# Altium schematic sheet 10.SchDoc
size 513 x 386 mm
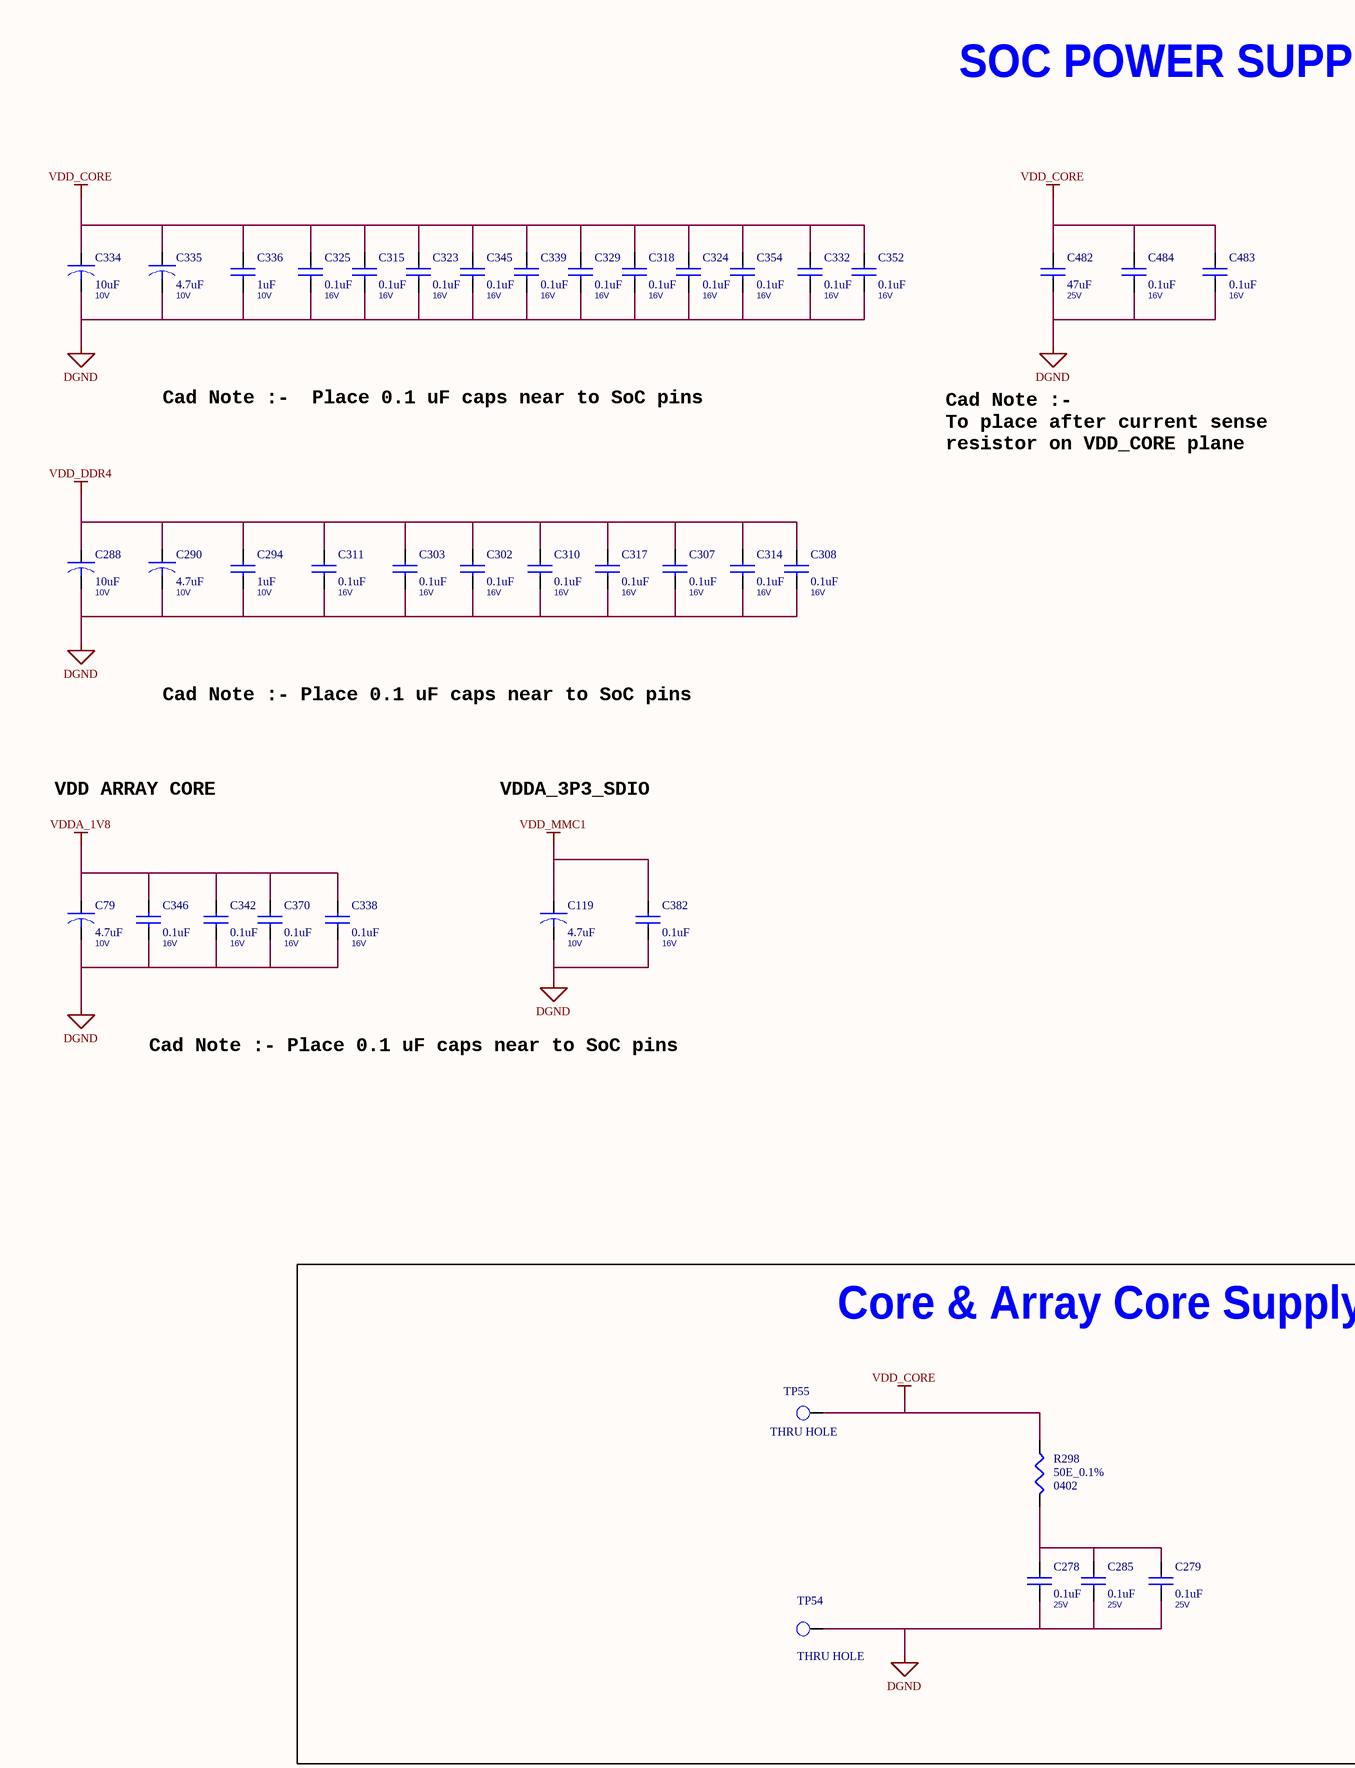
[diagram p0: 10.SchDoc, left]
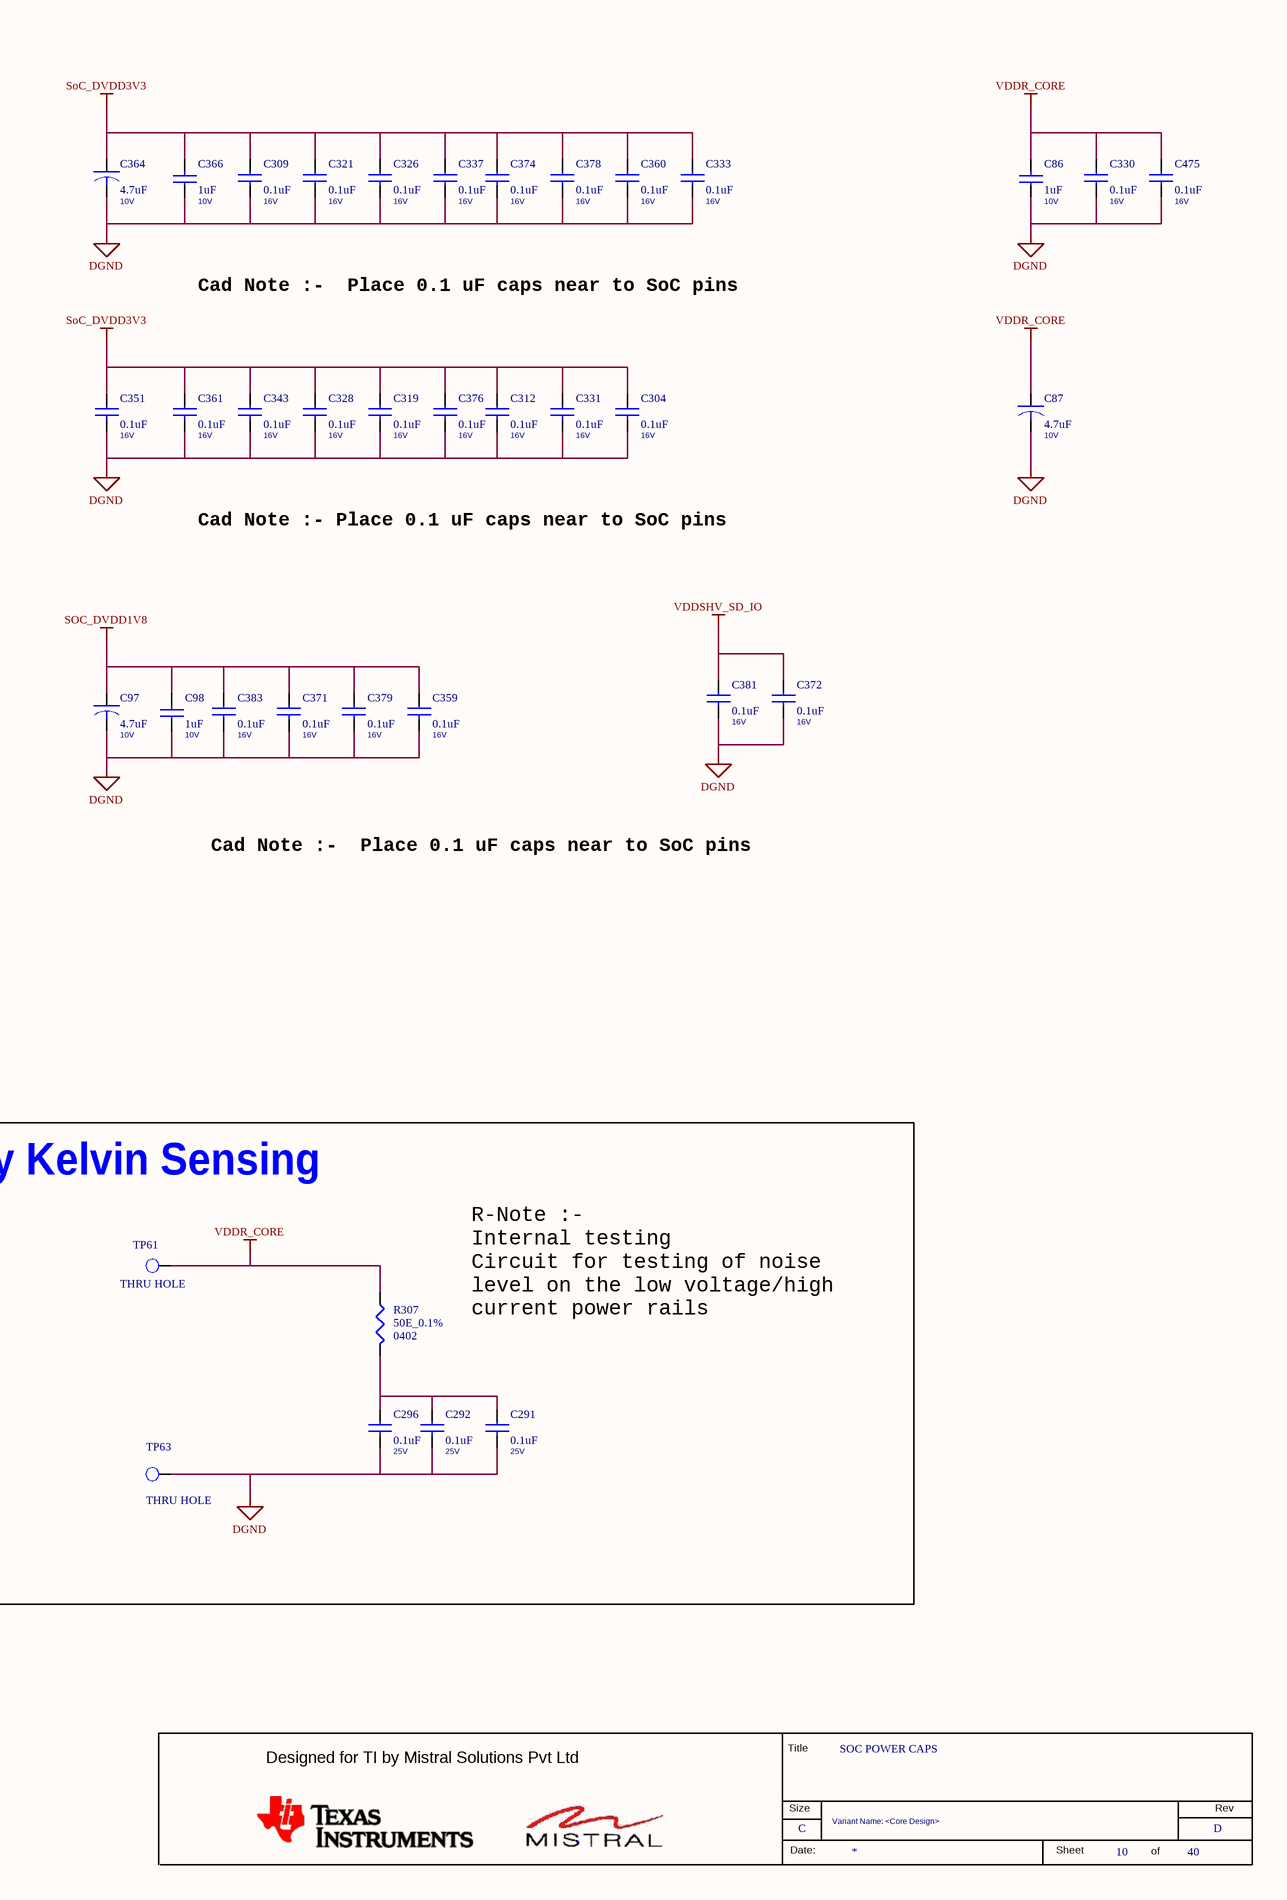
[diagram p1: 10.SchDoc, right]

## Parts
*  RevCode: D  Title: SOC POWER CAPS  Page Size: C  Page Number: 10  Page Count: 40  Variant Name: <Core Design>  (hidden comment: MISTRAL_TITLEBLK_CSIZE)  (graphical)
C79  4.7uF  Voltage: 10V  [CAP0402_0-75]
C86  1uF  Voltage: 10V  [CAP0402_0-75]
C87  4.7uF  Voltage: 10V  [CAP0402_0-75]
C97  4.7uF  Voltage: 10V  [CAP0402_0-75]
C98  1uF  Voltage: 10V  [CAP0402_0-75]
C119  4.7uF  Voltage: 10V  [CAP0402_0-75]
C278  0.1uF  Voltage: 25V  [CAP0402_0-75]
C279  0.1uF  Voltage: 25V  [CAP0402_0-75]
C285  0.1uF  Voltage: 25V  [CAP0402_0-75]
C288  10uF  Voltage: 10V  [CAP0402_0-75]
C290  4.7uF  Voltage: 10V  [CAP0402_0-75]
C291  0.1uF  Voltage: 25V  [CAP0402_0-75]
C292  0.1uF  Voltage: 25V  [CAP0402_0-75]
C294  1uF  Voltage: 10V  [CAP0402_0-75]
C296  0.1uF  Voltage: 25V  [CAP0402_0-75]
C302  0.1uF  Voltage: 16V  [CAP0201_0-5]
C303  0.1uF  Voltage: 16V  [CAP0201_0-5]
C304  0.1uF  Voltage: 16V  [CAP0201_0-5]
C307  0.1uF  Voltage: 16V  [CAP0201_0-5]
C308  0.1uF  Voltage: 16V  [CAP0201_0-5]
C309  0.1uF  Voltage: 16V  [CAP0201_0-5]
C310  0.1uF  Voltage: 16V  [CAP0201_0-5]
C311  0.1uF  Voltage: 16V  [CAP0201_0-5]
C312  0.1uF  Voltage: 16V  [CAP0201_0-5]
C314  0.1uF  Voltage: 16V  [CAP0201_0-5]
C315  0.1uF  Voltage: 16V  [CAP0201_0-5]
C317  0.1uF  Voltage: 16V  [CAP0201_0-5]
C318  0.1uF  Voltage: 16V  [CAP0201_0-5]
C319  0.1uF  Voltage: 16V  [CAP0201_0-5]
C321  0.1uF  Voltage: 16V  [CAP0201_0-5]
C323  0.1uF  Voltage: 16V  [CAP0201_0-5]
C324  0.1uF  Voltage: 16V  [CAP0201_0-5]
C325  0.1uF  Voltage: 16V  [CAP0201_0-5]
C326  0.1uF  Voltage: 16V  [CAP0201_0-5]
C328  0.1uF  Voltage: 16V  [CAP0201_0-5]
C329  0.1uF  Voltage: 16V  [CAP0201_0-5]
C330  0.1uF  Voltage: 16V  [CAP0201_0-5]
C331  0.1uF  Voltage: 16V  [CAP0201_0-5]
C332  0.1uF  Voltage: 16V  [CAP0201_0-5]
C333  0.1uF  Voltage: 16V  [CAP0201_0-5]
C334  10uF  Voltage: 10V  [CAP0402_0-75]
C335  4.7uF  Voltage: 10V  [CAP0402_0-75]
C336  1uF  Voltage: 10V  [CAP0402_0-75]
C337  0.1uF  Voltage: 16V  [CAP0201_0-5]
C338  0.1uF  Voltage: 16V  [CAP0201_0-5]
C339  0.1uF  Voltage: 16V  [CAP0201_0-5]
C342  0.1uF  Voltage: 16V  [CAP0201_0-5]
C343  0.1uF  Voltage: 16V  [CAP0201_0-5]
C345  0.1uF  Voltage: 16V  [CAP0201_0-5]
C346  0.1uF  Voltage: 16V  [CAP0201_0-5]
C351  0.1uF  Voltage: 16V  [CAP0201_0-5]
C352  0.1uF  Voltage: 16V  [CAP0201_0-5]
C354  0.1uF  Voltage: 16V  [CAP0201_0-5]
C359  0.1uF  Voltage: 16V  [CAP0201_0-5]
C360  0.1uF  Voltage: 16V  [CAP0201_0-5]
C361  0.1uF  Voltage: 16V  [CAP0201_0-5]
C364  4.7uF  Voltage: 10V  [CAP0402_0-75]
C366  1uF  Voltage: 10V  [CAP0402_0-75]
C370  0.1uF  Voltage: 16V  [CAP0201_0-5]
C371  0.1uF  Voltage: 16V  [CAP0201_0-5]
C372  0.1uF  Voltage: 16V  [CAP0201_0-5]
C374  0.1uF  Voltage: 16V  [CAP0201_0-5]
C376  0.1uF  Voltage: 16V  [CAP0201_0-5]
C378  0.1uF  Voltage: 16V  [CAP0201_0-5]
C379  0.1uF  Voltage: 16V  [CAP0201_0-5]
C381  0.1uF  Voltage: 16V  [CAP0201_0-5]
C382  0.1uF  Voltage: 16V  [CAP0201_0-5]
C383  0.1uF  Voltage: 16V  [CAP0201_0-5]
C475  0.1uF  Voltage: 16V  [CAP0201_0-5]
C482  47uF  Voltage: 25V  [CAP1206_2]
C483  0.1uF  Voltage: 16V  [CAP0201_0-5]
C484  0.1uF  Voltage: 16V  [CAP0201_0-5]
R298  50E_0.1%  Package: 0402  [RES0402_0-5]
R307  50E_0.1%  Package: 0402  [RES0402_0-5]
TP54  THRU HOLE  [TP_40X65]
TP55  THRU HOLE  [TP_40X65]
TP61  THRU HOLE  [TP_40X65]
TP63  THRU HOLE  [TP_40X65]

## Blocks framed on the sheet
Core & Array Core Supply Kelvin Sensing: C278 C279 C285 C291 C292 C296 R298 R307 TP54 TP55 TP61 TP63

## Nets
DGND: C79.2 C86.1 C87.2 C97.2 C98.1 C119.2 C278.2 C279.2 C285.2 C288.2 C290.2 C291.2 C292.2 C294.2 C296.2 C302.2 C303.2 C304.2 C307.2 C308.2 C309.2 C310.2 C311.2 C312.2 C314.2 C315.2 C317.2 C318.2 C319.2 C321.2 C323.2 C324.2 C325.2 C326.2 C328.2 C329.2 C330.2 C331.2 C332.2 C333.2 C334.2 C335.2 C336.2 C337.2 C338.2 C339.2 C342.2 C343.2 C345.2 C346.2 C351.2 C352.2 C354.2 C359.2 C360.2 C361.2 C364.2 C366.1 C370.2 C371.2 C372.2 C374.2 C376.2 C378.2 C379.2 C381.2 C382.2 C383.2 C475.2 C482.2 C483.2 C484.2 TP54.1(TP) TP63.1(TP)
SOC_DVDD1V8: C97.1 C98.2 C359.1 C371.1 C379.1 C383.1
SoC_DVDD3V3: C304.1 C309.1 C312.1 C319.1 C321.1 C326.1 C328.1 C331.1 C333.1 C337.1 C343.1 C351.1 C360.1 C361.1 C364.1 C366.2 C374.1 C376.1 C378.1
VDD_CORE: C315.1 C318.1 C323.1 C324.1 C325.1 C329.1 C332.1 C334.1 C335.1 C336.1 C339.1 C345.1 C352.1 C354.1 C482.1 C483.1 C484.1 R298.1 TP55.1(TP)
VDD_DDR4: C288.1 C290.1 C294.1 C302.1 C303.1 C307.1 C308.1 C310.1 C311.1 C314.1 C317.1
VDD_MMC1: C119.1 C382.1
VDDA_1V8: C79.1 C338.1 C342.1 C346.1 C370.1
VDDR_CORE: C86.2 C87.1 C330.1 C475.1 R307.1 TP61.1(TP)
VDDSHV_SD_IO: C372.1 C381.1
NetC278_1: C278.1 C279.1 C285.1 R298.2
NetC291_1: C291.1 C292.1 C296.1 R307.2

## Notes on the sheet
- SOC POWER SUPPLIES - DECAPS
- Cad Note :-
  To place after current sense
  resistor on VDD_CORE plane
- Cad Note :-  Place 0.1 uF caps near to SoC pins
- Cad Note :- Place 0.1 uF caps near to SoC pins
- VDD ARRAY CORE
- VDDA_3P3_SDIO
- R-Note :-
  Internal testing
  Circuit for testing of noise
  level on the low voltage/high
  current power rails
- (in symbol MISTRAL_TITLEBLK_CSIZE) Title; Designed for TI by Mistral Solutions Pvt Ltd; Size; Rev; Date:; Sheet; of

## Library data of the parts
* = MISTRAL_TITLEBLK_CSIZE: Issue: 1.0; Page Create Date: March  8, 1995; Page Modify Date: *
C79 C97 C335 = CAP_Dup1: CAP CERAMIC 4.7uF 10V 20% X5R 0402; Part_type: CAPACITORS\CERAMIC; Mfr_part_number: 0402ZD475MAT2A; Mfr_name: AVX CORPORATION; Mistral Part No: 120012060002-R; Custom_Duty: 15%; Customs_HS_Code: 85322990; Wattage: NA; Project: TI_MAXIE_CPB; Footprint Path: Y:\MIS_DATABASE\Library\ALTIUM_TOOL\PCB_FOOTPRINTS\Altium_Footprint_Lib.PcbLib; Library Path: Y:\MIS_DATABASE\Library\ALTIUM_TOOL\SCHEMATICS_PARTS\MS_DISCRETE_Library.schlib; MECHANICAL 3D STEP FILE: CAP0402_0-75; Chkd/date: MANIRAJA/230118; Crtd /date: MANIRAJA/230118; Datasheet: Y:\MIS_DATABASE\DATASHEETS\CAPACITORS\AVX_MLC.PDF; Temperature: -55癈+85癈; Weight: 0.65mg; Height: 0.71MM; Library Ref: CAP; Distributor_part_number: 478-10791-1-ND; Distributor_name: DIGIKEY; Package: 0402; Tolerance: 20%; Footprint Ref: CAP0402_0-75; PCB Footprint: CAP0402_0-75
C86 C98 = CAP_Dup3: CAP CERAMIC 1uF 10V 20% X5R 0402; Mistral Part No: 120020080009-R; Mfr_name: WURTH ELECTRONICS; Mfr_part_number: 885012105012; Part_type: CAPACITORS\CERAMIC; Project: AM64x_EVM_BRD; Wattage: NA; Customs_HS_Code: 85322990; Custom_Duty: 15%; Footprint Path: Y:\MIS_DATABASE\Library\ALTIUM_TOOL\PCB_FOOTPRINTS\Altium_Footprint_Lib.PcbLib; Library Path: Y:\MIS_DATABASE\Library\ALTIUM_TOOL\SCHEMATICS_PARTS\MS_DISCRETE_Library.schlib; MECHANICAL 3D STEP FILE: CAP0402_0-75; Tolerance: 20%; Package: 0402; Distributor_name: DIGIKEY; Distributor_part_number: 732-7489-1-ND; Height: 0.55MM; Weight: 0.65mg; Temperature: -55癈+85癈; Datasheet: Y:\MIS_DATABASE\DATASHEETS\CAPACITORS\885012105012.PDF; Crtd /date: ALVY/190820; Chkd/date: MANIRAJA/210820; Library Ref: CAP; Footprint Ref: CAP0402_0-75; PCB Footprint: CAP0402_0-75
C87 C119 C290 C364 = CAP_Dup1: CAP CERAMIC 4.7uF 10V 20% X5R 0402; Mistral Part No: 120012060002-R; Mfr_name: AVX CORPORATION; Mfr_part_number: 0402ZD475MAT2A; Part_type: CAPACITORS\CERAMIC; Project: TI_MAXIE_CPB; Wattage: NA; Customs_HS_Code: 85322990; Custom_Duty: 15%; Footprint Ref: CAP0402_0-75; Tolerance: 20%; Package: 0402; Distributor_name: DIGIKEY; Distributor_part_number: 478-10791-1-ND; Library Ref: CAP; Height: 0.71MM; Weight: 0.65mg; Temperature: -55癈+85癈; Datasheet: Y:\MIS_DATABASE\DATASHEETS\CAPACITORS\AVX_MLC.PDF; Crtd /date: MANIRAJA/230118; Chkd/date: MANIRAJA/230118; MECHANICAL 3D STEP FILE: CAP0402_0-75; Library Path: Y:\MIS_DATABASE\Library\ALTIUM_TOOL\SCHEMATICS_PARTS\MS_DISCRETE_Library.schlib; Footprint Path: Y:\MIS_DATABASE\Library\ALTIUM_TOOL\PCB_FOOTPRINTS\Altium_Footprint_Lib.PcbLib; PCB Footprint: CAP0402_0-75
C278 C279 C285 C291 C292 C296 = CAP_Dup3: CAP CERAMIC 0.1uF 25V 20% X5R 0402; Alt_Mfr_part_number: CC0402KRX5R8BB104; Mistral Part No: 120020080003-R; Mfr_name: WURTH ELECTRONICS; Mfr_part_number: 885012105018; Part_type: CAPACITORS\CERAMIC; Alt_Mfr_name: YAGEO AMERICA; Project: AM64x_EVM_BRD; Wattage: NA; Customs_HS_Code: 85322990; Custom_Duty: 15%; Tolerance: 20%; Package: 0402; Distributor_name: DIGIKEY; Distributor_part_number: 732-7495-1-ND; Height: 0.55MM; Weight: 0.65mg; Temperature: -55癈+85癈; Datasheet: Y:\MIS_DATABASE\DATASHEETS\CAPACITORS\885012105018.PDF; Crtd /date: ALVY/170820; Chkd/date: MANIRAJA/170820; MECHANICAL 3D STEP FILE: CAP0402_0-75; Library Ref: CAP; Footprint Ref: CAP0402_0-75; Library Path: Y:\MIS_DATABASE\Library\ALTIUM_TOOL\SCHEMATICS_PARTS\MS_DISCRETE_Library.schlib; Footprint Path: Y:\MIS_DATABASE\Library\ALTIUM_TOOL\PCB_FOOTPRINTS\Altium_Footprint_Lib.PcbLib; PCB Footprint: CAP0402_0-75
C288 = CAP_Dup1: CAP CERAMIC 10uF 10V 20% X5R 0402; Mistral Part No: 120013110019-R; Mfr_name: MURATA; Mfr_part_number: GRM155R61A106ME11D; Part_type: CAPACITORS\CERAMIC; Project: QCS610_NANOSOM; Wattage: NA; Customs_HS_Code: 85322990; Custom_Duty: 15%; Footprint Ref: CAP0402_0-75; Tolerance: 20%; Package: 0402; Distributor_name: DIGIKEY; Distributor_part_number: 490-GRM155R61A106ME11DTR-ND; Library Ref: CAP; Height: 0.55MM; Weight: 3.1mg; Temperature: -55癈+85癈; Datasheet: Y:\MIS_DATABASE\DATASHEETS\CAPACITORS\MURATA-GXX-SER_NOV17.PDF; Crtd /date: ALVY/260520; Chkd/date: MANIRAJA/300520; MECHANICAL 3D STEP FILE: CAP0402_0-75; Library Path: Y:\MIS_DATABASE\Library\ALTIUM_TOOL\SCHEMATICS_PARTS\MS_DISCRETE_Library.schlib; Footprint Path: Y:\MIS_DATABASE\Library\ALTIUM_TOOL\PCB_FOOTPRINTS\Altium_Footprint_Lib.PcbLib; PCB Footprint: CAP0402_0-75
C294 C336 C366 = CAP_Dup3: CAP CERAMIC 1uF 10V 20% X5R 0402; Part_type: CAPACITORS\CERAMIC; Mfr_part_number: 885012105012; Mfr_name: WURTH ELECTRONICS; Mistral Part No: 120020080009-R; Custom_Duty: 15%; Customs_HS_Code: 85322990; Wattage: NA; Project: AM64x_EVM_BRD; Footprint Ref: CAP0402_0-75; Library Ref: CAP; Chkd/date: MANIRAJA/210820; Crtd /date: ALVY/190820; Datasheet: Y:\MIS_DATABASE\DATASHEETS\CAPACITORS\885012105012.PDF; Temperature: -55癈+85癈; Weight: 0.65mg; Height: 0.55MM; Distributor_part_number: 732-7489-1-ND; Distributor_name: DIGIKEY; Package: 0402; Tolerance: 20%; MECHANICAL 3D STEP FILE: CAP0402_0-75; Library Path: Y:\MIS_DATABASE\Library\ALTIUM_TOOL\SCHEMATICS_PARTS\MS_DISCRETE_Library.schlib; Footprint Path: Y:\MIS_DATABASE\Library\ALTIUM_TOOL\PCB_FOOTPRINTS\Altium_Footprint_Lib.PcbLib; PCB Footprint: CAP0402_0-75
C302 C307 C308 C310-C312 C318 C319 C321 C323 C326 C328 C333 C339 C342 C345 C351 C352 C354 C360 C361 C370 C372 C374 C379 C383 C483 C484 = CAP_Dup3: CAP CERAMIC 0.1uF 16V 10% X5R 0201; Part_type: CAPACITORS\CERAMIC; Mfr_part_number: GRM033R61C104KE84J; Mfr_name: MURATA; Mistral Part No: 120009030072-R; Custom_Duty: 15%; Customs_HS_Code: 85322990; Wattage: NA; Project: TI_MAXIE_CPB; Footprint Path: Y:\MIS_DATABASE\Library\ALTIUM_TOOL\PCB_FOOTPRINTS\Altium_Footprint_Lib.PcbLib; Library Path: Y:\MIS_DATABASE\Library\ALTIUM_TOOL\SCHEMATICS_PARTS\MS_DISCRETE_Library.schlib; Footprint Ref: CAP0201_0-5; MECHANICAL 3D STEP FILE: CAP0201_0-5; Chkd/date: MANIRAJA/120218; Crtd /date: MANIRAJA/120218; Datasheet: Y:\MIS_DATABASE\DATASHEETS\CAPACITORS\GRM033R61C104KE84.PDF; Temperature: -55癈+85癈; Weight: 0.33mg; Height: 0.33MM; Distributor_part_number: 490-16742-1-ND; Distributor_name: DIGIKEY; Package: 0201; Tolerance: 10%; Library Ref: CAP; PCB Footprint: CAP0201_0-5
C303 C304 C309 C314 C315 C317 C324 C325 C329-C332 C337 C338 C343 C346 C359 C371 C376 C378 C381 C382 C475 = CAP_Dup3: CAP CERAMIC 0.1uF 16V 10% X5R 0201; Mistral Part No: 120009030072-R; Mfr_name: MURATA; Mfr_part_number: GRM033R61C104KE84J; Part_type: CAPACITORS\CERAMIC; Project: TI_MAXIE_CPB; Wattage: NA; Customs_HS_Code: 85322990; Custom_Duty: 15%; Footprint Path: Y:\MIS_DATABASE\Library\ALTIUM_TOOL\PCB_FOOTPRINTS\Altium_Footprint_Lib.PcbLib; Library Path: Y:\MIS_DATABASE\Library\ALTIUM_TOOL\SCHEMATICS_PARTS\MS_DISCRETE_Library.schlib; Footprint Ref: CAP0201_0-5; Library Ref: CAP; Tolerance: 10%; Package: 0201; Distributor_name: DIGIKEY; Distributor_part_number: 490-16742-1-ND; Height: 0.33MM; Weight: 0.33mg; Temperature: -55癈+85癈; Datasheet: Y:\MIS_DATABASE\DATASHEETS\CAPACITORS\GRM033R61C104KE84.PDF; Crtd /date: MANIRAJA/120218; Chkd/date: MANIRAJA/120218; MECHANICAL 3D STEP FILE: CAP0201_0-5; PCB Footprint: CAP0201_0-5
C334 = CAP_Dup1: CAP CERAMIC 10uF 10V 20% X5R 0402; Part_type: CAPACITORS\CERAMIC; Mfr_part_number: GRM155R61A106ME11D; Mfr_name: MURATA; Mistral Part No: 120013110019-R; Custom_Duty: 15%; Customs_HS_Code: 85322990; Wattage: NA; Project: QCS610_NANOSOM; Footprint Path: Y:\MIS_DATABASE\Library\ALTIUM_TOOL\PCB_FOOTPRINTS\Altium_Footprint_Lib.PcbLib; Library Path: Y:\MIS_DATABASE\Library\ALTIUM_TOOL\SCHEMATICS_PARTS\MS_DISCRETE_Library.schlib; MECHANICAL 3D STEP FILE: CAP0402_0-75; Chkd/date: MANIRAJA/300520; Crtd /date: ALVY/260520; Datasheet: Y:\MIS_DATABASE\DATASHEETS\CAPACITORS\MURATA-GXX-SER_NOV17.PDF; Temperature: -55癈+85癈; Weight: 3.1mg; Height: 0.55MM; Library Ref: CAP; Distributor_part_number: 490-GRM155R61A106ME11DTR-ND; Distributor_name: DIGIKEY; Package: 0402; Tolerance: 20%; Footprint Ref: CAP0402_0-75; PCB Footprint: CAP0402_0-75
C482 = CAP_Dup3: CAP CERAMIC 47uF 25V 20% X5R 1206; Mistral Part No: 120013050002-R; Mfr_name: MURATA; Mfr_part_number: GRM31CR61E476ME44L; Part_type: CAPACITORS\CERAMIC; Project: TI_MAXIE_CPB; Wattage: NA; Customs_HS_Code: 85322990; Custom_Duty: 15%; Tolerance: 20%; Package: 1206; Distributor_name: DIGIKEY; Distributor_part_number: 490-16268-1-ND; Height: 1.80MM; Weight: 40mg; Temperature: -55癈+85癈; Datasheet: Y:\MIS_DATABASE\DATASHEETS\CAPACITORS\MURATA-GXX-SER_NOV17.PDF; Crtd /date: MANIRAJA/230118; Chkd/date: MANIRAJA/230118; MECHANICAL 3D STEP FILE: CAP1206_2; Library Ref: CAP; Footprint Ref: CAP1206_2; Library Path: Y:\MIS_DATABASE\Library\ALTIUM_TOOL\SCHEMATICS_PARTS\MS_DISCRETE_Library.schlib; Footprint Path: Y:\MIS_DATABASE\Library\ALTIUM_TOOL\PCB_FOOTPRINTS\Altium_Footprint_Lib.PcbLib; PCB Footprint: CAP1206_2
R298 R307 = RESISTOR_Dup6: RES 50E 1/20W 0.1% 0402; Mistral Part No: 110011050025-R; Mfr_name: VISHAY; Mfr_part_number: FC0402E50R0BST1; Part_type: RESISTORS\FIXED; Project: TE_MODULE; Voltage: NA; Customs_HS_Code: 85332119; Custom_Duty: 15%; PCB Footprint: RES0402_0-5; Tolerance: 0.1%; Wattage: 1/20W; Distributor_name: DIGIKEY; Distributor_part_number: FC0402-50BWCT-ND; Library Ref: RESISTOR; Height: 0.42MM; Weight: 0.65mg; Temperature: -55癈+155癈; Datasheet: Y:\MIS_DATABASE\DATASHEETS\RESISTORS\FC_SER_MAR18.PDF; Crtd /date: BAVISH/260511; Chkd/date: MANIRAJA/110917; MECHANICAL 3D STEP FILE: RES0402_0-5; Footprint Ref: RES0402_0-5; Library Path: Y:\MIS_DATABASE\Library\ALTIUM_TOOL\SCHEMATICS_PARTS\MS_DISCRETE_Library.schlib; Footprint Path: Y:\MIS_DATABASE\Library\ALTIUM_TOOL\PCB_FOOTPRINTS\Altium_Footprint_Lib.PcbLib
TP54 TP63 = TESTPOINT: TESTPOINT 1.0MM DRILL PTH; Mfr_name: LOCAL; Mistral Part No: 130009030938; Project: HSE; PCB Footprint: TP_40X65; Library Ref: TESTPOINT; Chkd/date: MAZHAR/271211; Crtd /date: SHREESHAIL/041005; Datasheet: NA; Height: NA; Distributor_part_number: NA; Distributor_name: NA; Package: THRU-HOLE; Part_type: TESTPOINT; Mfr_part_number: TP_40X65
TP55 TP61 = TESTPOINT: TESTPOINT 1.0MM DRILL PTH; Mistral Part No: 130009030938; Mfr_name: LOCAL; Project: HSE; Mfr_part_number: TP_40X65; Part_type: TESTPOINT; Package: THRU-HOLE; Distributor_name: NA; Distributor_part_number: NA; Height: NA; Datasheet: NA; Crtd /date: SHREESHAIL/041005; Chkd/date: MAZHAR/271211; Library Ref: TESTPOINT; PCB Footprint: TP_40X65